# EAGLE design utilidong-ftdi-uart-mk-2.2 (EAGLE 7.5.0)
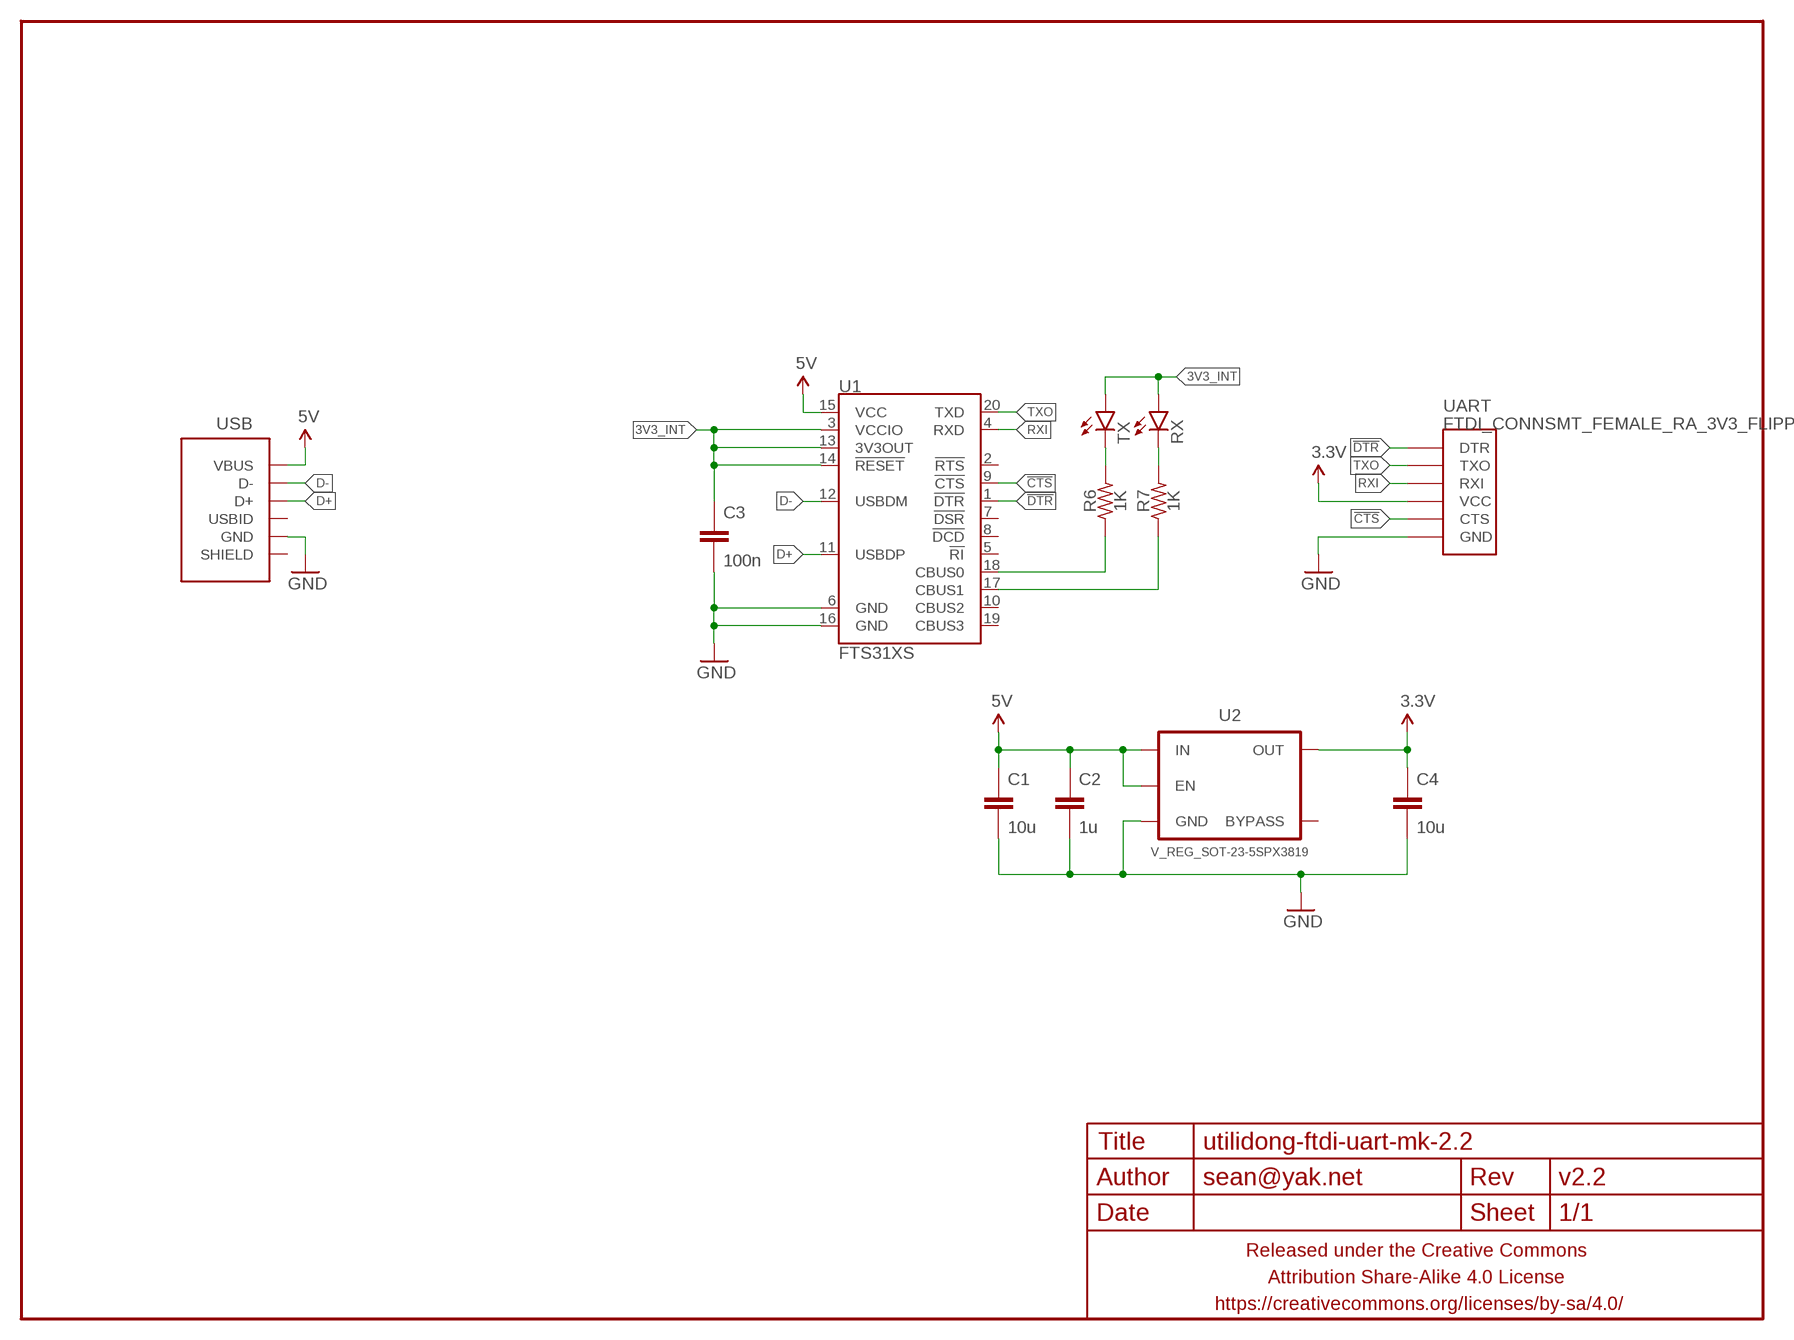
[diagram p0: schematic, sheet 1]

## Parts
C1  10u  CAPACITOR-CERAMICC0805  [C0805]
C2  1u  CAPACITOR-CERAMICC0603-TIGHTER  [C0603-TIGHTER]
C3  100n  CAPACITOR-CERAMICC0603-TIGHTER  [C0603-TIGHTER]
C4  10u  CAPACITOR-CERAMICC0805  [C0805]
FRAME1  FRAME-LETTERNO_PACKAGE  [DUMMY]
R6  1K  RESISTORR0603-TIGHTER  [R0603-TIGHTER]
R7  1K  RESISTORR0603-TIGHTER  [R0603-TIGHTER]
RX  LED0603-TIGHT  [LED-0603-TIGHT]
TX  LED0603-TIGHT  [LED-0603-TIGHT]
U1  FTS31XS  FT231XS  [SSOP20_L]
U2  V_REG_SOT-23-5SPX3819  [SOT23-5]
UART  FTDI_CONNSMT_FEMALE_RA_3V3_FLIPPED  [FTDI_CONN_SMT_FEMALE_RA_3V3_FLIPPED]
USB  USB-AB-SHIELDFCI-10103594-USB-MICRO-B-EVENLESS  [FCI-101035840-USB-MICRO-B-EVENLESS]

## Nets
3.3V: C4.1 U2.5(OUT) UART.4(VCC)
3V3_INT: C3.1 RX.A TX.A U1.3(VCCIO) U1.13(3V3OUT) U1.14(!RESET)
5V: C1.1 C2.1 U1.15(VCC) U2.1(IN) U2.3(EN) USB.1(VBUS)
!CTS: U1.9(!CTS) UART.5(CTS)
!DTR: U1.1(!DTR) UART.1(DTR)
D+: U1.11(USBDP) USB.3(D+)
D-: U1.12(USBDM) USB.2(D-)
GND: C1.2 C2.2 C3.2 C4.2 U1.6(GND) U1.16(GND) U2.2(GND) UART.6(GND) USB.5(GND)
N$7: R6.1 U1.18(CBUS0)
N$9: R6.2 TX.C
N$10: R7.2 RX.C
N$12: R7.1 U1.17(CBUS1)
RXI: U1.4(RXD) UART.3(RXI)
TXO: U1.20(TXD) UART.2(TXO)
Unconnected: U1.2(!RTS) U1.5(!RI) U1.7(!DSR) U1.8(!DCD) U1.10(CBUS2) U1.19(CBUS3) U2.4(BYPASS) USB.4(USBID) USB.SHIELD@1(SHIELD) USB.SHIELD@2(SHIELD) USB.SHIELD@3(SHIELD) USB.SHIELD@4(SHIELD) USB.SHIELD@5(SHIELD) USB.SHIELD@6(SHIELD)

## Library data of the parts
C1-C4 = a_parts:CAPACITOR-CERAMIC: CAPACITOR, European symbol
FRAME1 = A_butts:FRAME-LETTER: Schematic Frame Standard 8.5x11 US Letter frame; DESIGNER: sean@yak.net; VERSION: v2.2
R6 R7 = a_parts:RESISTOR: RESISTOR, American symbol
RX TX = a_parts:LED: LEDs Standard schematic elements and footprints for 5mm, 3mm, 1206, and 0603 sized LEDs. 5mm - Spark Fun Electronics SKU : COM-00529 (and others)
U1 = a_parts:FT231X: FTDI FT231X Full Speed USB to Full-handshake UART This USB2.0 Full Speed IC offers a compact bridge to full handshake UART interfaces. The device is a UART, capable of operating up to 3MBaud, with low power consumption (8mA). The FT231X includes the complete FT-X series feature set and enables USB to be added into a system design quickly and easily over a UART interface.; PROD_ID: IC-11524; VALUE: FTS31XS-U
U2 = a_parts:V_REG_SOT-23-5
UART = a_parts:FTDI_CONN: Connector which mates to FTDI basic or FTDI cable.
USB = a_parts:USB-AB-SHIELD

## Board
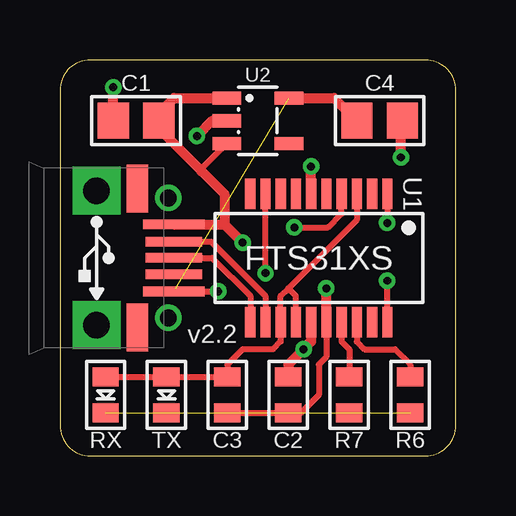
[diagram p1: board, top side]
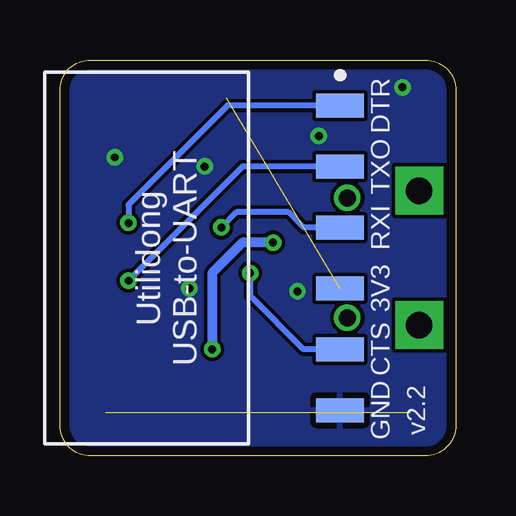
[diagram p2: board, bottom side, seen from below]

Size 16.51 x 16.51 mm. Coordinates in mm from the lower left corner, seen from the top.
Outline: 16.51,1.27 16.51,15.24 arc90 15.24,16.51 1.27,16.51 arc90 0,15.24 0,1.27 arc90 1.27,0 15.24,0 arc90 16.51,1.27
Copper layers (1*16): Top 0.0356mm / dielectric 1.5011mm / Bottom 0.0356mm
Design rules "LaenPCBOrder2": minimum track width 6mil, minimum drill 13mil, track to track 6mil, track to pad 6mil, pad to pad 6mil, via to via 6mil, smd to smd 6mil, copper to edge 15mil, drill to drill 6mil, minimum pad ring 7mil, minimum via ring 7mil, stop-mask expansion 3mil, vias tented up to drill 20mil, thermal gap 10mil

### Footprints (pad centres in the part's own frame; a part is rotated, then mirrored left to right if it is on the bottom)
C0805 = smd 1.3 x 1.5: 1 -0.95,0; 2 0.95,0
C0603-TIGHTER = smd 0.8 x 1.1: 1 -0.75,0; 2 0.75,0
R0603-TIGHTER = smd 0.8 x 1.1: 1 -0.75,0; 2 0.75,0
LED-0603-TIGHT = smd 0.8 x 1.1: A 0.75,0; C -0.75,0
SSOP20_L = smd 0.43 x 1.27: 1 -2.857,-2.68; 2 -2.223,-2.68; 3 -1.587,-2.68; 4 -0.953,-2.68; 5 -0.318,-2.68; 6 0.318,-2.68; 7 0.953,-2.68; 8 1.587,-2.68; 9 2.223,-2.68; 10 2.857,-2.68; 11 2.857,2.68; 12 2.223,2.68; 13 1.587,2.68; 14 0.953,2.68; 15 0.318,2.68; 16 -0.318,2.68; 17 -0.953,2.68; 18 -1.587,2.68; 19 -2.223,2.68; 20 -2.857,2.68
SOT23-5 = smd 0.55 x 1.2: 1 -0.95,-1.3; 2 0,-1.3; 3 0.95,-1.3; 4 0.95,1.3; 5 -0.95,1.3
FTDI_CONN_SMT_FEMALE_RA_3V3_FLIPPED = smd 2 x 1: 1 0,-6.35; 2 0,-3.81; 3 0,-1.27; 4 0,1.27; 5 0,3.81; 6 0,6.35
FCI-101035840-USB-MICRO-B-EVENLESS = smd 0.4 x 2.55: 1 -1.4,3.225; 5 1.4,3.225 | smd 0.4 x 2.35: 2 -0.675,3.225; 3 0,3.225; 4 0.675,3.225 | drill 0.7 pad 1.1: SHIELD@1 -2.5,3; SHIELD@2 2.5,3 | drill 1.1 pad 2 square: SHIELD@3 -2.8,0; SHIELD@4 2.8,0 | smd 2 x 0.9: SHIELD@5 -2.9,1.7; SHIELD@6 2.9,1.7

### Placement (x,y rotation side)
C1  3.17,13.97 180 top
C2  9.53,2.54 270 top
C3  6.99,2.54 270 top
C4  13.34,13.97 0 top
FRAME1  0,0 0 top
R6  14.61,2.54 270 top
R7  12.06,2.54 270 top
RX  1.91,2.54 90 top
TX  4.45,2.54 90 top
U1  10.79,8.26 180 top
U2  8.26,13.97 270 top
UART  4.83,8.26 180 bottom
USB  1.52,8.26 270 top

### Tracks (layer width: path | path; a pad name or v marks a point on that pad's centre or on a via)
3.3V  (1 unrouted)
  Top 0.406: U2.5 11.44,14.92 C4.1
3V3_INT
  Top 0.254: 9.53,6.99 12.38,9.84 U1.3 | 9.53,6.99 9.21,6.67 U1.13 9.21,4.76 8.89,4.45 7.62,4.45 6.99,3.81 C3.1 TX.A RX.A | U1.14 9.84,6.67 9.53,6.99
5V  (via drill 0.33)
  Top 0.254: U2.3 5.91,11.97 5.91,11.87
  Top 0.406: U1.15 10.48,4.76 v10.16,4.45 9.53,3.81 C2.1 | U2.1 4.76,14.92 4.12,14.29 C1.1 4.12,13.65 5.91,11.87 6.86,10.92 6.86,9.65 | USB.1 6.86,9.65 | 6.86,9.65 v7.62,8.89
  Bottom 0.406: v10.16,4.45 10.16,7.62 8.89,8.89 v7.62,8.89
!CTS  (via drill 0.33)
  Top 0.254: v8.57,7.62 U1.9
  Bottom 0.254: UART.5 6.35,4.45 8.57,6.67 v8.57,7.62
!DTR  (via drill 0.33)
  Top 0.254: U1.1 v13.65,9.72
  Bottom 0.254: UART.1 9.53,14.61 13.65,10.48 v13.65,9.72
D+
  Top 0.254: USB.3 6.35,8.26 7.94,6.67 U1.11
D-
  Top 0.254: USB.2 6.31,8.93 8.57,6.67 U1.12
GND  (via drill 0.33)
  Top 0.254: U1.16 11.11,4.13 10.79,3.81 10.79,2.54 10.04,1.79 C2.2 C3.2 | USB.5 v6.6,6.86
  Top 0.406: U1.16 v11.11,6.99 | U1.6 v10.48,12.06 | C1.2 v2.23,15.37 | U2.2 6.35,13.97 v5.71,13.34 | v14.22,12.45 14.22,13.97 C4.2
  pour Bottom: 1.27,16.51 15.24,16.51 arc-90 16.51,15.24 16.51,1.27 arc-90 15.24,0 1.27,0 arc-90 0,1.27 0,15.24 arc-90
N$7
  Top 0.254: U1.18 12.38,4.76 12.7,4.45 13.97,4.45 14.61,3.81 R6.1
N$9  (1 unrouted)
N$10  (1 unrouted)
N$12
  Top 0.254: U1.17 11.75,4.76 12.06,4.45 R7.1
RXI  (via drill 0.33)
  Top 0.254: v9.78,9.53 11.18,9.53 11.75,10.1 U1.4
  Bottom 0.254: UART.3 6.35,9.53 6.99,10.16 9.14,10.16 v9.78,9.53
TXO  (via drill 0.33)
  Top 0.254: U1.20 v13.65,7.3
  Bottom 0.254: UART.2 8.89,12.06 v13.65,7.3

### Text on the board
bPlace: Utilidong / USB-to-UART